# Altium schematic sheet MCU.SchDoc
size 381 x 241 mm; SheetNumber: 2; SheetTotal: 3
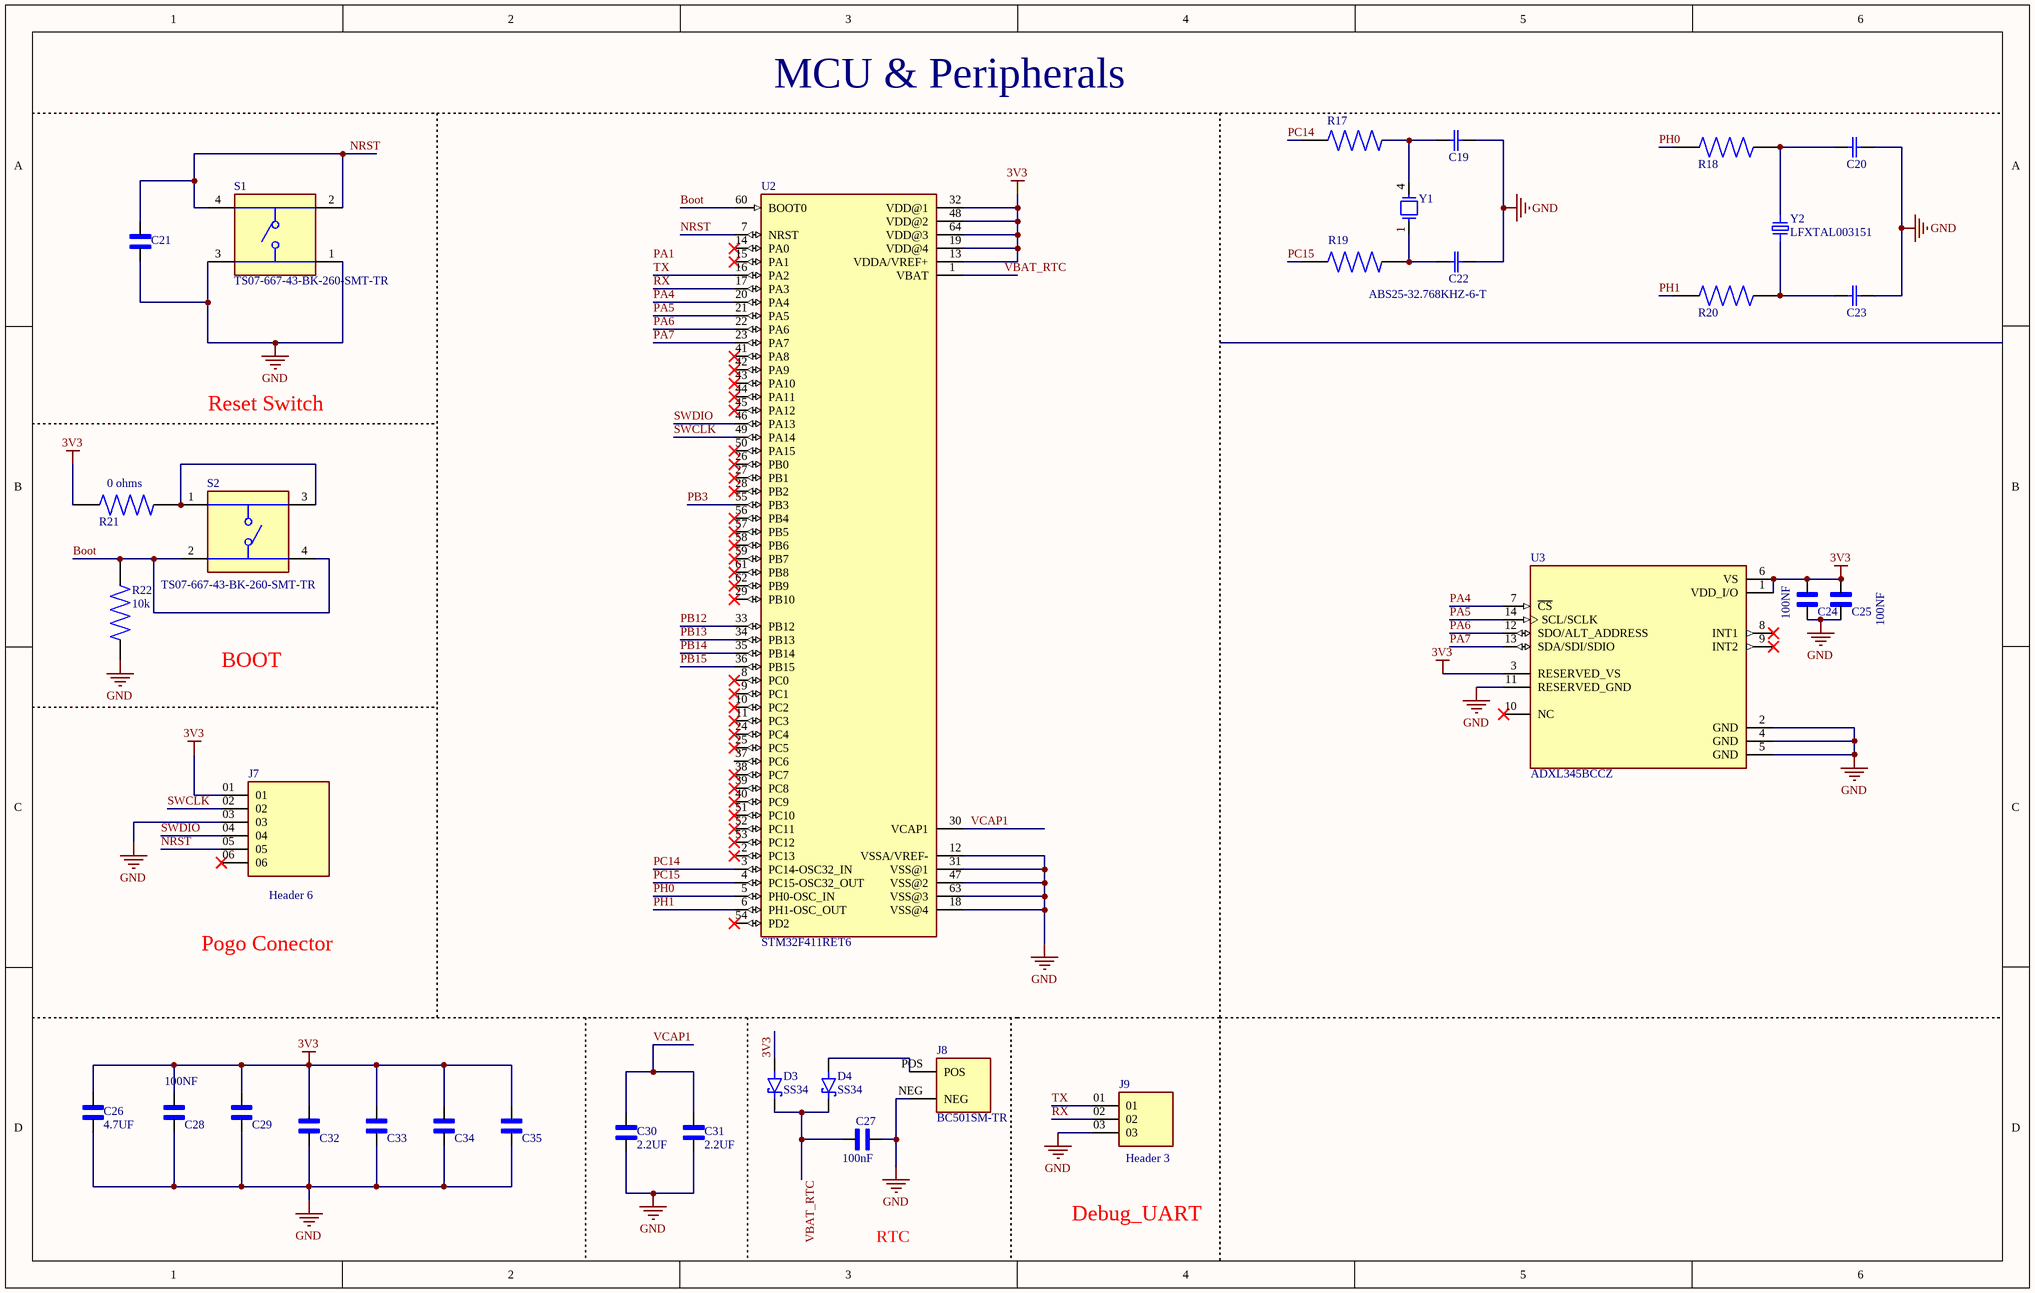
[diagram p0: MCU.SchDoc]

## Parts
C19  C0603C200J5GACTU  [CAPC1608X85N]  (value not drawn)
C20  C0603C200J5GACTU  [CAPC1608X85N]  (value not drawn)
C21  C0603C104J3RACTU  [CAPC1608X90]  (value not drawn)
C22  C0603C200J5GACTU  [CAPC1608X85N]  (value not drawn)
C23  C0603C200J5GACTU  [CAPC1608X85N]  (value not drawn)
C24  100NF  [CAPC1608X90]
C25  100NF  [CAPC1608X90]
C26  4.7UF  [CAPC2012X135N]
C27  100nF  [CAPC1608X90]
C28  100NF  [CAPC1608X90]
C29  C0603C104J3RACTU  [CAPC1608X90]  (value not drawn)
C30  2.2UF  [CAPC2012X135N]
C31  2.2UF  [CAPC2012X135N]
C32  C0603C104J3RACTU  [CAPC1608X90]  (value not drawn)
C33  C0603C104J3RACTU  [CAPC1608X90]  (value not drawn)
C34  C0603C104J3RACTU  [CAPC1608X90]  (value not drawn)
C35  C0603C104J3RACTU  [CAPC1608X90]  (value not drawn)
D3  SS34  [DIO_SS34]
D4  SS34  [DIO_SS34]
J7  Header 6  [SAMTEC_MTLW-106-06-G-S-180]
J8  BC501SM-TR  [MPD_BC501SM-TR]
J9  Header 3  [SAMTEC_HMTSW-103-XX-X-S-XXX]
R17  AC1206FR-070RL  [RESC3116X65N]  (value not drawn)
R18  AC1206FR-070RL  [RESC3116X65N]  (value not drawn)
R19  AC1206FR-070RL  [RESC3116X65N]  (value not drawn)
R20  AC1206FR-070RL  [RESC3116X65N]  (value not drawn)
R21  0 ohms  [RESC3116X65N]
R22  10k  [RESC2012X60N]
S1  TS07-667-43-BK-260-SMT-TR  [SW_TS07-667-43-BK-260-SMT-TR]
S2  TS07-667-43-BK-260-SMT-TR  [SW_TS07-667-43-BK-260-SMT-TR]
U2  STM32F411RET6  [QFP50P1200X1200X160-64N]
U3  ADXL345BCCZ  [IC_ADXL345BCCZ]
Y1  ABS25-32.768KHZ-6-T  [XTAL_ABS25-32.768KHZ-6-T]
Y2  LFXTAL003151  [WE-XTAL_HC49/4HSMX]

## Nets
3V3: C24.2 C25.2 C26.1 C28.2 C29.2 C32.2 C33.2 C34.2 C35.2 D3.A J7.01 R21.2 U2.13(VDDA/VREF+) U2.19(VDD@4) U2.32(VDD@1) U2.48(VDD@2) U2.64(VDD@3) U3.1(VDD_I/O) U3.3(RESERVED_VS) U3.6(VS)
GND: C19.2(C2) C20.1(C1) C21.2 C22.1(C1) C23.2(C2) C24.1 C25.1 C26.2 C27.1 C28.1 C29.1 C30.2 C31.2 C32.1 C33.1 C34.1 C35.1 J7.03 J8.NEG J9.03 S1.1 S1.3 U2.12(VSSA/VREF-) U2.18(VSS@4) U2.31(VSS@1) U2.47(VSS@2) U2.63(VSS@3) U3.2(GND) U3.4(GND) U3.5(GND) U3.11(RESERVED_GND)
Boot: R22.2 S2.2 S2.4 U2.60(BOOT0)
NRST: C21.1 J7.05 S1.2 S1.4 U2.7(NRST)
PA4: U2.20(PA4) U3.7(~{CS})
PA5: U2.21(PA5) U3.14(SCL/SCLK)
PA6: U2.22(PA6) U3.12(SDO/ALT_ADDRESS)
PA7: U2.23(PA7) U3.13(SDA/SDI/SDIO)
PB3: U2.55(PB3)
PB12: U2.33(PB12)
PB13: U2.34(PB13)
PB14: U2.35(PB14)
PB15: U2.36(PB15)
PC14: R17.1 U2.3(PC14-OSC32_IN)
PC15: R19.1 U2.4(PC15-OSC32_OUT)
PH0: R18.1 U2.5(PH0-OSC_IN)
PH1: R20.1 U2.6(PH1-OSC_OUT)
RX: J9.02 U2.17(PA3)
SWCLK: J7.02 U2.49(PA14)
SWDIO: J7.04 U2.46(PA13)
TX: J9.01 U2.16(PA2)
VBAT_RTC: C27.2 D3.C(K) D4.C(K) U2.1(VBAT)
VCAP1: C30.1 C31.1 U2.30(VCAP1)
NetC19_1: C19.1(C1) R17.2 Y1.4
NetC20_2: C20.2(C2) R18.2 Y2.2
NetC22_2: C22.2(C2) R19.2 Y1.1
NetC23_1: C23.1(C1) R20.2 Y2.1
NetD4_A: D4.A J8.POS
NetR21_1: R21.1 S2.1 S2.3

Not connected (* = marked no-connect by the designer): J7 06*; R22 1; U2 2(PC13)* 8(PC0)* 9(PC1)* 10(PC2)* 11(PC3)* 14(PA0)* 15(PA1)* 24(PC4)* 25(PC5)* 26(PB0)* 27(PB1)* 28(PB2)* 29(PB10)* 37(PC6) 38(PC7)* 39(PC8)* 40(PC9)* 41(PA8)* 42(PA9)* 43(PA10)* 44(PA11)* 45(PA12)* 50(PA15)* 51(PC10)* 52(PC11)* 53(PC12)* 54(PD2)* 56(PB4)* 57(PB5)* 58(PB6)* 59(PB7)* 61(PB8)* 62(PB9)*; U3 8(INT1)* 9(INT2)* 10(NC)*

## Notes on the sheet
- MCU & Peripherals
- Reset Switch
- BOOT
- Pogo Conector
- RTC
- Debug_UART
- Labels drawn without touching a wire or pin: GND, PA1

## Library data of the parts
C19 C20 C22 C23 = C0603C200J5GACTU: Capacitor Ceramic C0G 0603 50V 20pF | KEMET C0603C200J5GACTU; SnapEDA_Link: https://www.snapeda.com/parts/C0603C200J5GACTU/KEMET/view-part/?ref=snap; Package: 0603 Kemet; Value: *; MF: KEMET; MP: C0603C200J5GACTU; Check_prices: https://www.snapeda.com/parts/C0603C200J5GACTU/KEMET/view-part/?ref=eda
C21 C24 C25 C27-C29 C32-C35 = C0603C104J3RACTU: 0603 C 100nF Ceramic Multilayer Capacitor, 25 V, +125degC, X7R Dielectric, +/-5% | KEMET C0603C104J3RACTU; SnapEDA_Link: https://www.snapeda.com/parts/C0603C104J3RACTU/KEMET/view-part/?ref=snap; Package: 603-2 KEMET; Value: *; MF: KEMET; MP: C0603C104J3RACTU; Check_prices: https://www.snapeda.com/parts/C0603C104J3RACTU/KEMET/view-part/?ref=eda
C26 C30 C31 = CL21B225KPFNNNG: 2.2 ÂµF Â±10% 10V Ceramic Capacitor X7R 0805 (2012 Metric); MF: Samsung; SnapEDA_Link: https://www.snapeda.com/parts/CL21B225KPFNNNG/Samsung/view-part/?ref=snap; Package: SMD-2 Samsung; Value: *; MP: CL21B225KPFNNNG; Check_prices: https://www.snapeda.com/parts/CL21B225KPFNNNG/Samsung/view-part/?ref=eda
D3 D4 = SS34: 3A, 40V, Schottky Rectifier; MF: Taiwan Semiconductor; SnapEDA_Link: https://www.snapeda.com/parts/SS34/taiwan/view-part/?ref=snap; Package: DO-214AB-2 Taiwan Semiconductor; Value: *; MP: SS34; Check_prices: https://www.snapeda.com/parts/SS34/taiwan/view-part/?ref=eda
J7 = MTLW-106-06-G-S-180: Package: None; MP: MTLW-106-06-G-S-180; Price: None; Availability: Unavailable; Value: *
J8 = BC501SM-TR: Battery Holder (Open) Coin, 12.0mm 1 Cell SMD (SMT) Tab; MF: MPD (Memory; SnapEDA_Link: https://www.snapeda.com/parts/BC501SM-TR/MPD/view-part/?ref=snap; Package: DFN-8 MPD; Value: *; MP: BC501SM-TR; Check_prices: https://www.snapeda.com/parts/BC501SM-TR/MPD/view-part/?ref=eda
J9 = HMTSW-103-XX-X-S-XXX: Connector Unshrouded Header 3 Position 2.54mm Solder Straight Through Hole; MF: Samtec; MP: HMTSW-103-10-T-S-330; SnapEDA_Link: https://www.snapeda.com/parts/HMTSW-103-10-T-S-330/Samtec/view-part/?ref=snap; Package: None; Value: *; Check_prices: https://www.snapeda.com/parts/HMTSW-103-10-T-S-330/Samtec/view-part/?ref=eda
R17-R21 = AC1206FR-070RL: 0 Ohms Jumper Chip Resistor 1206 (3216 Metric) Automotive AEC-Q200 Thick Film; MF: Yageo; SnapEDA_Link: https://www.snapeda.com/parts/AC1206FR-070RL/Yageo/view-part/?ref=snap; Package: SMD-2 Yageo; Value: *; MP: AC1206FR-070RL; Check_prices: https://www.snapeda.com/parts/AC1206FR-070RL/Yageo/view-part/?ref=eda
R22 = CR0805-JW-331ELF: Res 0805 330R 5% 125mW | Bourns CR0805-JW-331ELF; SnapEDA_Link: https://www.snapeda.com/parts/CR0805-JW-331ELF/Bourns/view-part/?ref=snap; Package: 0805 Bourns; Value: *; MF: Bourns; MP: CR0805-JW-331ELF; Check_prices: https://www.snapeda.com/parts/CR0805-JW-331ELF/Bourns/view-part/?ref=eda
S1 S2 = TS07-667-43-BK-260-SMT-TR: 6 x 6.7 mm, 4.3 mm Actuator Height, 260 gf, Black, Surface Mount, SPST, Tactile Switch; MF: Same Sky; SnapEDA_Link: https://www.snapeda.com/parts/TS07-667-43-BK-260-SMT-TR/Same+Sky/view-part/?ref=snap; Package: None; Value: *; MP: TS07-667-43-BK-260-SMT-TR; Check_prices: https://www.snapeda.com/parts/TS07-667-43-BK-260-SMT-TR/Same+Sky/view-part/?ref=eda
U2 = STM32F411RET6: ARMÂ® CortexÂ®-M4 STM32F4 Mikrodenetleyici IC 32-Bit Tek Ã‡ekirdek 100MHz 512KB (512K x 8) FLASH 64-LQFP (10x10); MF: STMicroelectronics; SnapEDA_Link: https://www.snapeda.com/parts/STM32F411RET6/STMicroelectronics/view-part/?ref=snap; Package: LQFP-64 STMicroelectronics; Value: *; MP: STM32F411RET6; Check_prices: https://www.snapeda.com/parts/STM32F411RET6/STMicroelectronics/view-part/?ref=eda
U3 = ADXL345BCCZ: 3-Axis, Â±2 g/Â±4 g/Â±8 g/Â±16 g Digital Accelerometer; MF: Analog Devices; SnapEDA_Link: https://www.snapeda.com/parts/ADXL345BCCZ/Analog+Devices/view-part/?ref=snap; Package: LGA -14 Analog Devices; Value: *; MP: ADXL345BCCZ; Check_prices: https://www.snapeda.com/parts/ADXL345BCCZ/Analog+Devices/view-part/?ref=eda
Y1 = ABS25-32.768KHZ-6-T: 32.768 kHz Â±20ppm Crystal 6pF 50 kOhms 4-SOJ, 5.50mm pitch; MF: Abracon; SnapEDA_Link: https://www.snapeda.com/parts/ABS25-32.768KHZ-6-T/Abracon/view-part/?ref=snap; Package: 4-4 Abracon; Value: *; MP: ABS25-32.768KHZ-6-T; Check_prices: https://www.snapeda.com/parts/ABS25-32.768KHZ-6-T/Abracon/view-part/?ref=eda
Y2 = LFXTAL003151: 8 MHz Â±30ppm Crystal 16pF 40 Ohms HC-49/US; MF: IQD Frequency Products; SnapEDA_Link: https://www.snapeda.com/parts/LFXTAL003151/IQD+Frequency+Products/view-part/?ref=snap; Package: HC-49/US IQD Frequency Products; Value: *; MP: LFXTAL003151; Check_prices: https://www.snapeda.com/parts/LFXTAL003151/IQD+Frequency+Products/view-part/?ref=eda